# EAGLE design drv (EAGLE 7.2.0)
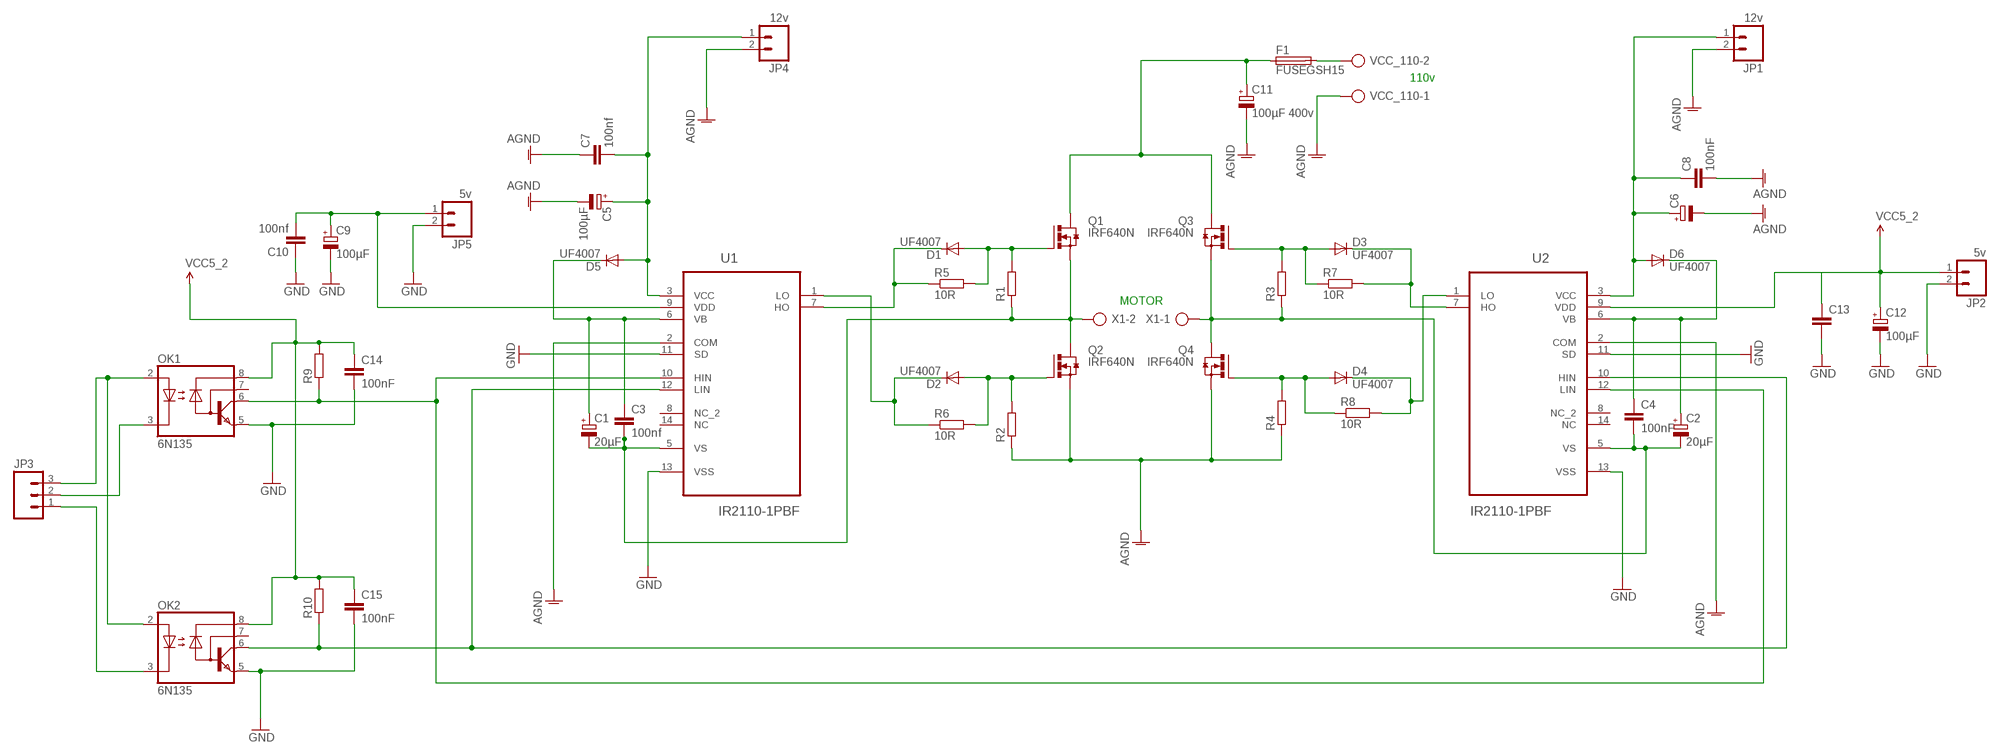
[diagram p0: schematic, sheet 1]

## Parts
C1  20µF  CPOL-EUE2,5-6E  [E2,5-6E]
C2  20µF  CPOL-EUE2,5-6E  [E2,5-6E]
C3  100nf  C-EUC0805  [C0805]
C4  100nF  C-EUC0504  [C0504]
C5  100µF  CPOL-EUE2-5  [E2-5]
C6  CPOL-EUE2-5  [E2-5]
C7  100nf  C-EUC1310  [C1310]
C8  100nF  C-EUC0805  [C0805]
C9  100µF  CPOL-EUE2-5  [E2-5]
C10  100nf  C-EUC0805  [C0805]
C11  100µF 400v  CPOL-EUE10-25  [EB25D]
C12  100µF  CPOL-EUE2-5  [E2-5]
C13  C-EUC0805  [C0805]
C14  100nF  C-EUC0805  [C0805]
C15  100nF  C-EUC0805  [C0805]
D1  UF4007  DIODE  [DIODE-1N4001-KIT]
D2  UF4007  DIODE  [DIODE-1N4001-KIT]
D3  UF4007  DIODE  [DIODE-1N4001-KIT]
D4  UF4007  DIODE  [DIODE-1N4001-KIT]
D5  UF4007  DIODE  [DIODE-1N4001-KIT]
D6  UF4007  DIODE  [DIODE-1N4001-KIT]
F1  FUSEGSH15  [GSH15]
JP1  12v  M02JST-PTH-VERT  [JST-2-PTH-VERT]
JP2  5v  M02JST-PTH-VERT  [JST-2-PTH-VERT]
JP3  M03LOCK  [1X03_LOCK]
JP4  12v  M02JST-PTH-VERT  [JST-2-PTH-VERT]
JP5  5v  M02JST-PTH-VERT  [JST-2-PTH-VERT]
OK1  6N135  [DIL08]
OK2  6N135  [DIL08]
Q1  IRF640N  IRF3704  [TO220AH]
Q2  IRF640N  IRF3704  [TO220AH]
Q3  IRF640N  IRF3704  [TO220AH]
Q4  IRF640N  IRF3704  [TO220AH]
R1  R-EU_0207/12  [0207/12]
R2  R-EU_0207/12  [0207/12]
R3  R-EU_0207/12  [0207/12]
R4  R-EU_0207/12  [0207/12]
R5  10R  R-EU_0207/12  [0207/12]
R6  10R  R-EU_0207/12  [0207/12]
R7  10R  R-EU_0207/12  [0207/12]
R8  10R  R-EU_0207/12  [0207/12]
R9  R-EU_R0805  [R0805]
R10  R-EU_R0805  [R0805]
U1  IR2110-1PBF  [DIP254P762X533-14]
U2  IR2110-1PBF  [DIP254P762X533-14]
VCC_110  AK300/2  [AK300/2]
X1  AK300/2  [AK300/2]

## Nets
110_1: F1.2 VCC_110.2
AGND: C5.- C6.- C7.1 C8.2 C11.- JP1.2 JP4.2 Q2.E(S) Q4.E(S) R2.1 R4.1 U1.2(COM) U2.2(COM) VCC_110.1
GND: C9.- C10.1 C12.- C13.2 C14.2 C15.2 JP2.2 JP5.2 OK1.5(GND) OK2.5(GND) U1.11(SD) U1.13(VSS) U2.11(SD) U2.13(VSS)
N$1: D1.A Q1.B(G) R1.2 R5.2
N$3: JP3.3 OK1.2(A) OK2.2(A)
N$4: D2.A Q2.B(G) R2.2 R6.2
N$5: D1.C R5.1 U1.7(HO)
N$6: JP3.2 OK1.3(C)
N$7: D2.C R6.1 U1.1(LO)
N$9: D3.A Q3.B(G) R3.2 R7.1
N$10: D3.C R7.2 U2.7(HO)
N$11: D4.C R8.2 U2.1(LO)
N$12: JP3.1 OK2.3(C)
N$14: D4.A Q4.B(G) R4.2 R8.1
N$15: C1.+ C3.1 D5.C U1.6(VB)
N$17: C2.+ C4.1 D6.C U2.6(VB)
N$18: OK1.6(VO) R9.1 U1.10(HIN) U2.12(LIN)
N$21: OK2.6(VO) R10.1 U1.12(LIN) U2.10(HIN)
OUT1: C2.- C4.2 Q3.E(S) Q4.C(D) R3.1 U2.5(VS) X1.1
OUT2: C1.- C3.2 Q1.E(S) Q2.C(D) R1.1 U1.5(VS) X1.2
VCC5_2: C12.+ C13.1 C14.1 C15.1 JP2.1 OK1.8(VCC) OK2.8(VCC) R9.2 R10.2 U2.9(VDD)
VCC_5_1: C9.+ C10.2 JP5.1 U1.9(VDD)
VCC_12_1: C5.+ C7.2 D5.A JP4.1 U1.3(VCC)
VCC_12_2: C6.+ C8.1 D6.A JP1.1 U2.3(VCC)
VCC_110: C11.+ F1.1 Q1.C(D) Q3.C(D)
Unconnected: OK1.7(VB) OK2.7(VB) U1.8(NC_2) U1.14(NC) U2.8(NC_2) U2.14(NC)

## Notes on the sheet
- 110v
- MOTOR

## Library data of the parts
C1 C2 C5 C6 C9 C11 C12 = rcl:CPOL-EU: POLARIZED CAPACITOR, European symbol
C3 C4 C7 C8 C10 C13-C15 = rcl:C-EU: CAPACITOR, European symbol
D1-D6 = SparkFun-DiscreteSemi:DIODE: Diode These are standard reverse protection diodes and small signal diodes. SMA package can handle up to about 1A. SOD-323 can handle about 200mA. What the SOD-323 package when ordering, there are some mfgs out there that are 5-pin packages.
F1 = fuse:FUSE: Fuse; OC_FARNELL: unknown; OC_NEWARK: unknown
JP1 JP2 JP4 JP5 = SparkFun-Connectors:M02: Standard 2-pin 0.1" header. Use with - straight break away headers ( PRT-00116) - right angle break away headers (PRT-00553) - swiss pins (PRT-00743) - machine pins (PRT-00117) - female headers (PRT-00115) Molex polarized connector foot print use with: PRT-08233 with associated crimp pins and housings. 2.54_SCREWTERM for use with PRT-10571. 3.5mm Screw Terminal footprints for PRT-08084 5mm Screw Terminal footprints for use with PRT-08433
JP3 = SparkFun-Connectors:M03: Header 3 Standard 3-pin 0.1" header. Use with straight break away headers (SKU : PRT-00116), right angle break away headers (PRT-00553), swiss pins (PRT-00743), machine pins (PRT-00117), and female headers (PRT-00115). Molex polarized connector foot print use with SKU : PRT-08232 with associated crimp pins and housings.
OK1 OK2 = optocoupler:6N135: MOTOROLA OPTO COUPLER; MF: FAIRCHILD SEMICONDUCTOR; MPN: 6N135; OC_FARNELL: 1021342; OC_NEWARK: 58K9658
Q1-Q4 = transistor-power:IRF3704: SMPS MOSFET HEXFET® Power MOSFET Source: http://www.irf.com/product-info/datasheets/data/irf3704.pdf
R1-R10 = rcl:R-EU_: RESISTOR, European symbol
U1 U2 = International_Rectifier_By_element14_Batch_1:IR2110-1PBF: HIGH AND LOW SIDE DRIVER; MPN: IR2110-1PBF; OC_FARNELL: 1374799; OC_NEWARK: 19K8414; PACKAGE: PDIP-14; SUPPLIER: INTERNATIONAL RECTIFIER
VCC_110 X1 = con-ptr500:AK300/2: CONNECTOR; OC_FARNELL: unknown; OC_NEWARK: unknown

## Board
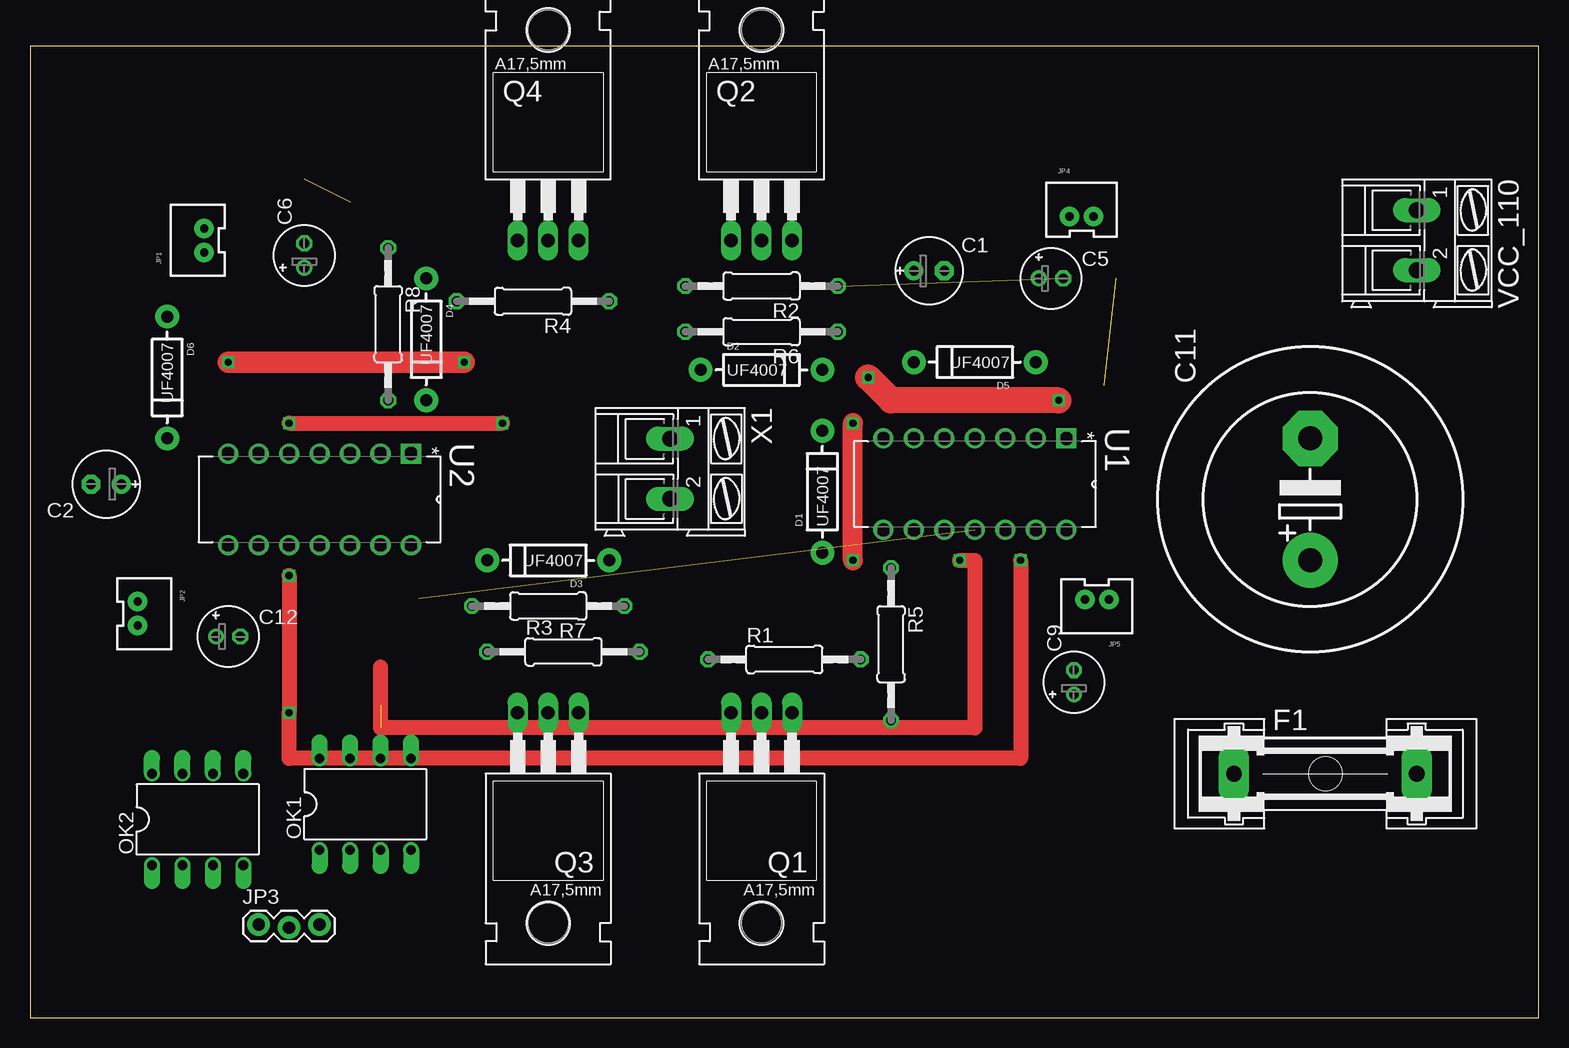
[diagram p1: board, top side]
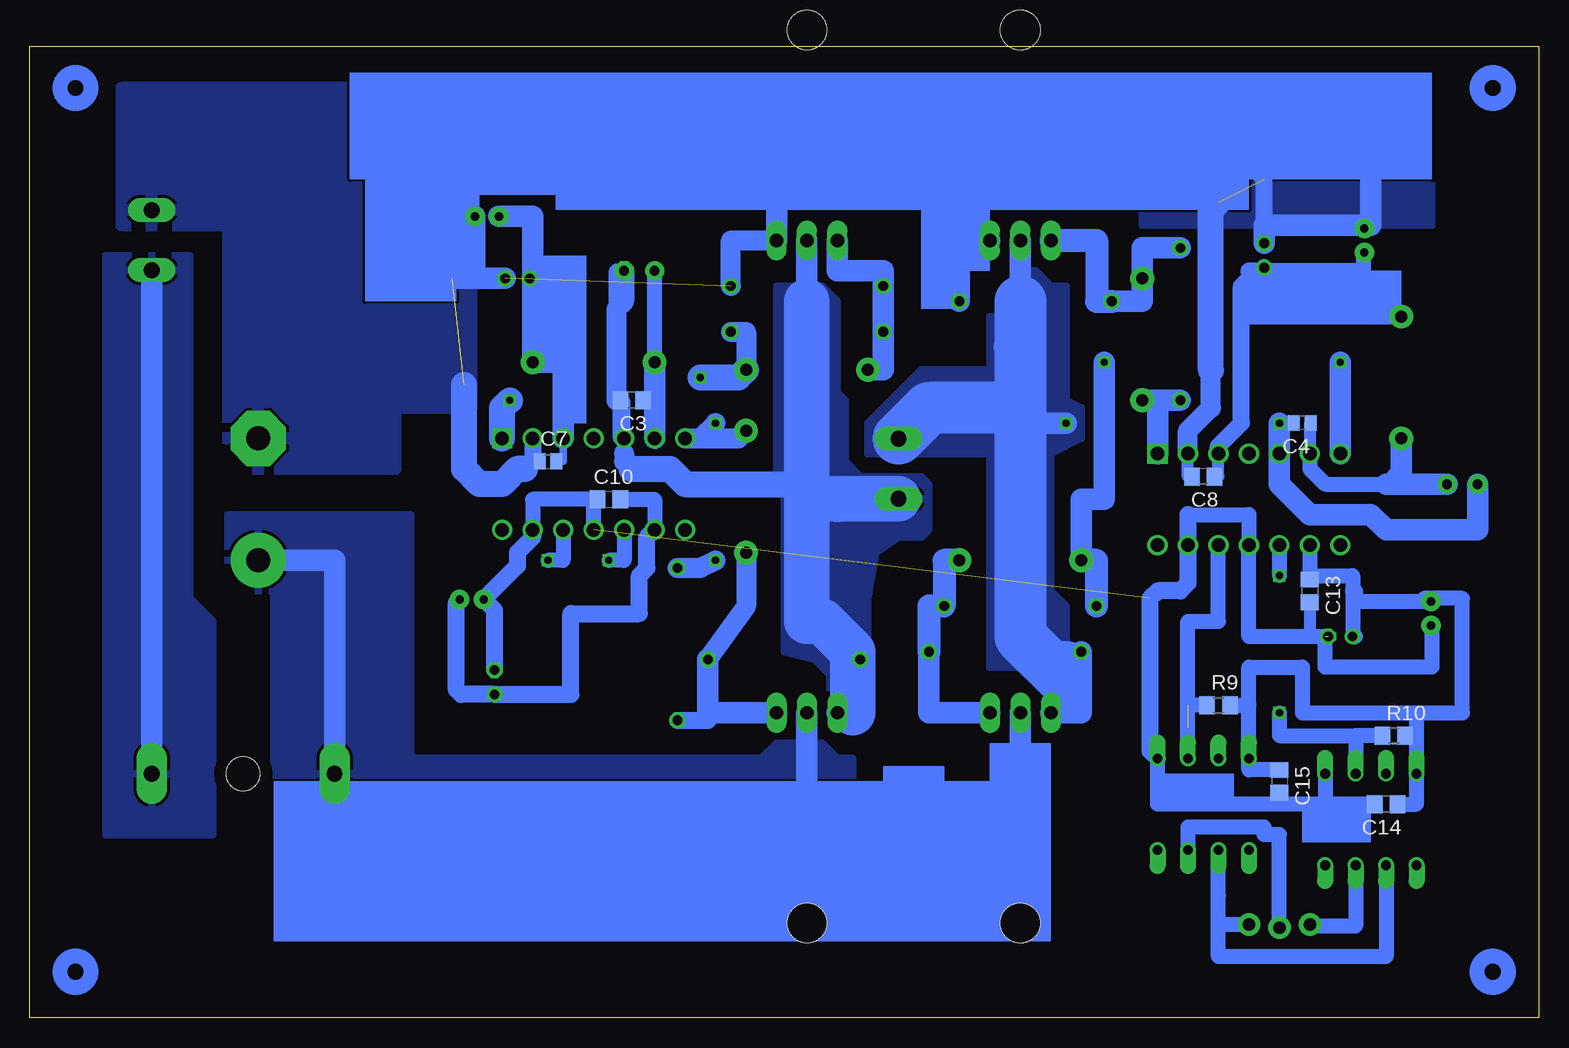
[diagram p2: board, bottom side, seen from below]

Size 125.71 x 80.95 mm. Coordinates in mm from the lower left corner, seen from the top.
Outline: 0,0 125.71,0 125.71,80.95 0,80.95 0,0
Copper layers (1*16): Top 0.035mm / dielectric 1.5mm / Bottom 0.035mm
Design rules "default": minimum track width 10mil, minimum drill 24mil, track to track 8mil, track to pad 8mil, pad to pad 8mil, via to via 8mil, smd to smd 8mil, copper to edge 40mil, drill to drill 8mil, minimum pad ring 10mil, minimum via ring 8mil, stop-mask expansion 4mil, vias tented up to drill 0mil, thermal gap 10mil

### Footprints (pad centres in the part's own frame; a part is rotated, then mirrored left to right if it is on the bottom)
E2,5-6E = drill 0.813 pad 1.575: + -1.27,0 | drill 0.813 pad 1.575 octagon: - 1.27,0
C0805 = smd 1.3 x 1.5: 1 -0.95,0; 2 0.95,0
C0504 = smd 1 x 1.3: 1 -0.7,0; 2 0.7,0
E2-5 = drill 0.813 pad 1.27: + -1.016,0 | drill 0.813 pad 1.27 octagon: - 1.016,0
C1310 = smd 1 x 1.3: 1 -0.7,0; 2 0.7,0
EB25D = drill 2.007 pad 4.597: + -5.08,0 | drill 2.007 pad 4.597 octagon: - 5.08,0
DIODE-1N4001-KIT = drill 1 pad 1.981: A -5.08,0; C 5.08,0
GSH15 = drill 1.321 pad 2.54 long: 1 -7.62,0; 2 7.62,0 | hole 2.794: 0,0
JST-2-PTH-VERT = drill 0.7 pad 1.626: 1 -1,-0.55; 2 1,-0.55
1X03_LOCK = drill 1.016 pad 1.88: 1 0,0.127; 2 2.54,-0.127; 3 5.08,0.127
DIL08 = drill 0.813 offset: 1 -3.81,-3.81; 2 -1.27,-3.81; 3 1.27,-3.81; 4 3.81,-3.81; 5 3.81,3.81; 6 1.27,3.81; 7 -1.27,3.81; 8 -3.81,3.81
TO220AH = drill 1.118 long: B -2.54,-6.35; C 0,-6.35; E 2.54,-6.35 | hole 3.302: 0,11.176
0207/12 = drill 0.813 octagon: 1 -6.35,0; 2 6.35,0
R0805 = smd 1.3 x 1.5: 1 -0.95,0; 2 0.95,0
DIP254P762X533-14 = drill 1.118 square: 1 -7.62,15.24 | drill 1.118: 2 -7.62,12.7; 3 -7.62,10.16; 4 -7.62,7.62; 5 -7.62,5.08; 6 -7.62,2.54; 7 -7.62,0; 8 0,0; 9 0,2.54; 10 0,5.08; 11 0,7.62; 12 0,10.16; 13 0,12.7; 14 0,15.24
AK300/2 = drill 1.321 long: 1 -2.515,0; 2 2.489,0

### Placement (x,y rotation side)
C1  74.93,62.23 0 top
C2  6.35,44.45 180 top
C3  75.56,51.43 180 bottom
C4  19.68,49.53 180 bottom
C5  85.09,61.6 0 top
C6  22.86,63.5 90 top
C7  82.55,46.35 0 bottom
C8  27.94,45.09 180 bottom
C9  87,27.94 90 top
C10  77.47,43.18 0 bottom
C11  106.68,43.18 90 top
C12  16.51,31.75 0 top
C13  19.05,35.56 270 bottom
C14  12.7,17.78 180 bottom
C15  21.59,19.68 270 bottom
D1  66.04,43.82 90 top
D2  60.96,53.98 0 top
D3  43.18,38.1 180 top
D4  33.02,56.51 270 top
D5  78.74,54.61 180 top
D6  11.43,53.34 270 top
F1  107.95,20.32 0 top
JP1  13.97,64.77 90 top
JP2  9.53,33.65 270 top
JP3  19.05,7.62 0 top
JP4  87.63,67.31 0 top
JP5  88.9,34.29 180 top
OK1  27.94,17.78 0 top
OK2  13.97,16.51 0 top
Q1  60.96,19.05 180 top
Q2  60.96,71.12 0 top
Q3  43.18,19.05 180 top
Q4  43.18,71.12 0 top
R1  62.87,29.85 0 top
R2  60.96,60.96 180 top
R3  44.45,30.48 0 top
R4  41.91,59.69 180 top
R5  71.75,31.12 270 top
R6  60.96,57.15 180 top
R7  43.18,34.29 180 top
R8  29.84,57.79 270 top
R9  26.67,26.04 0 bottom
R10  12.06,23.49 0 bottom
U1  71.12,40.64 270 top
U2  16.51,39.37 270 top
VCC_110  115.57,64.77 270 top
X1  53.34,45.72 270 top

### Tracks (layer width: path | path; a pad name or v marks a point on that pad's centre or on a via)
110_1
  Bottom 1.778: VCC_110.2 F1.2
  pour Bottom: 112.39,63.5 119.38,63.5 119.38,15.24 110.49,15.24 110.49,33.02 112.39,34.93
AGND  (3 unrouted)
  Bottom 0.61: C7.1 83.82,46.35
  Bottom 1.016: C8.2 29.21,45.09 U2.2
  Bottom 1.422: 22.86,66.04 22.86,69.85 29.21,76.2 46.99,76.2 48.26,74.93 48.26,64.77 | U1.2 83.82,46.35 84.45,45.72
  Bottom 1.676: R2.1 67.31,64.77 Q2.E | U2.2 29.21,48.9 27.3,50.8 27.3,53.98
  Bottom 1.778: 90.53,61.6 88.63,61.6 | 88.63,61.6 JP4.2 | C5.- 88.63,61.6 | Q4.E 46.99,64.77 46.99,76.2 | 46.99,76.2 31.75,76.2 31.75,74.93 13.97,74.93 13.97,66.04 22.86,66.04 C6.- | Q2.E 63.5,76.2 46.99,76.2 | R4.1 48.26,64.77 48.26,72.39
  Bottom 2.184: 27.3,53.98 27.3,67.31 26.67,67.94 | 84.45,45.72 85.09,45.72 86.36,44.45 88.27,44.45 89.53,45.72 89.53,52.71
  pour Bottom: 13.97,66.04 8.89,66.04 8.89,77.47 33.02,77.47 33.02,66.04
  pour Bottom: 33.02,77.47 88.9,77.47 88.27,69.85 63.5,71.12 45.72,71.12 45.72,68.58 31.75,68.58 33.02,76.2
  pour Bottom: 88.9,77.47 118.11,77.47 118.11,66.04 109.22,66.04 109.22,45.72 95.25,45.72 95.25,50.8 88.9,50.8 88.9,76.2
GND  (2 unrouted)
  Bottom 1.016: C13.2 19.05,31.75
  Bottom 1.27: U2.13 29.21,41.91 24.13,41.91 U2.11 24.13,31.75 19.05,31.75 17.78,31.75 17.78,29.21 8.89,29.21 8.89,32.65 JP2.2 | OK2.5 17.78,17.78 | 17.78,17.78 21.59,17.78 | 21.59,17.78 31.75,17.78 OK1.5 | C14.2 17.78,17.78 | C15.2 21.59,17.78 | C10.1 78.74,43.18 | 78.74,43.18 83.82,43.18 U1.13 | U1.11 78.74,43.18
  Bottom 1.422: C9.- 87,33.93 JP5.2 85.09,37.65 85.09,38.73 83.82,40.01 U1.13 | 29.21,41.91 29.21,36.2 29.84,35.56 31.75,35.56 32.38,34.93 32.38,22.23 OK1.5
N$1
  Bottom 1.422: R5.2 69.22,24.76 68.58,25.4
  Bottom 1.676: D1.A 66.04,34.29 R1.2
  Bottom 1.778: Q1.B 68.58,25.4 69.22,25.4 R1.2
N$2
  pour Bottom: 46.99,16.51 46.99,13.97 41.91,17.78
N$3
  Bottom 1.27: JP3.3 26.67,7.75 | 26.67,7.75 26.67,10.16 OK1.2 | OK2.2 12.7,5.08 26.67,5.08 26.67,7.75
N$4
  Bottom 1.778: Q2.B 58.42,62.23 54.61,62.23 R2.2 R6.2 54.61,53.98 D2.A
N$5  (via drill 0.6)
  Top 1.676: v68.58,38.1 v68.58,49.53
  Bottom 1.676: U1.7 69.85,48.26 | 69.85,48.26 66.67,48.26 D1.C | R5.1 69.85,37.46 v68.58,38.1 | v68.58,49.53 69.85,48.26
N$6
  Bottom 1.27: JP3.2 21.59,15.24 22.86,15.24 22.86,15.87 29.21,15.87 OK1.3
N$7  (via drill 0.6)
  Top 2.184: v85.72,51.43 71.75,51.43 v69.85,53.34
  Bottom 1.676: R6.1 66.04,57.15 D2.C
  Bottom 2.184: U1.1 86.36,50.8 v85.72,51.43 | v69.85,53.34 66.67,53.34 D2.C
N$9
  Bottom 1.778: Q3.B 50.8,25.4 R3.2
  Bottom 1.93: R3.2 50.8,34.29 R7.1 49.53,38.1 D3.A
N$10  (via drill 0.6)
  Top 1.778: v36.2,54.61 v16.51,54.61
  Bottom 1.778: 38.1,39.37 D3.C 38.1,43.18 36.2,43.18 v36.2,54.61 | v16.51,54.61 U2.7
  Bottom 1.93: R7.2 36.83,38.1 D3.C
N$11
  Bottom 1.778: R8.2 31.75,51.43 | 31.75,51.43 D4.C | U2.1 31.75,51.43
N$12
  Bottom 1.27: OK2.3 15.24,7.62 19.05,7.62 JP3.1
N$14
  Bottom 1.778: R8.1 33.02,64.13 D4.A 33.02,59.69 R4.2
  Bottom 1.93: Q4.B 36.83,64.77 36.83,59.69 R4.2
N$15
  Bottom 1.27: C3.1 73.66,51.43 73.66,52.07 | D5.C C1.+
  Bottom 1.778: U1.6 73.66,52.07 D5.C
N$17
  Bottom 1.016: C4.1 19.05,49.53 U2.6
  Bottom 1.27: U2.6 19.05,45.72 17.78,44.45 12.7,44.45 11.43,45.72
  Bottom 1.778: 11.43,44.45 11.43,45.72 D6.C | C2.+ 11.43,44.45 | 11.43,44.45 12.7,44.45
N$18  (via drill 0.6)  (1 unrouted)
  Top 1.27: v77.47,38.1 78.74,38.1 78.74,24.13 29.21,24.13 29.21,29.21
  Bottom 1.27: OK1.6 29.21,26.04 | 29.21,26.04 29.21,33.02 26.67,33.02 U2.12 | R9.1 29.21,26.04 | U1.10 76.2,38.1 v77.47,38.1
N$21  (via drill 0.6)
  Top 1.27: v21.59,36.83 v21.59,25.4 21.59,21.59 82.55,21.59 v82.55,38.1
  Bottom 1.27: U2.10 v21.59,36.83 | v21.59,25.4 21.59,23.49 15.24,23.49 | 15.24,23.49 OK2.6 | R10.1 15.24,23.49 | U1.12 81.28,38.1 v82.55,38.1
OUT1  (via drill 0.6)
  Top 1.27: v21.59,49.53 v39.37,49.53
  Bottom 1.016: C4.2 v21.59,49.53 | 39.37,29.21 38.1,29.21 R3.1
  Bottom 1.27: U2.5 v21.59,49.53 | 44.45,50.8 44.45,55.88
  Bottom 1.778: R3.1 38.1,25.4 Q3.E | v21.59,49.53 21.59,44.45 19.05,41.91 13.97,41.91 12.7,40.64 5.08,40.64 C2.- | v39.37,49.53 43.18,49.53 | Q4.C 43.18,59.69
  Bottom 1.93: 44.45,55.88 43.18,55.88 43.18,57.15
  Bottom 4.318: 43.18,49.53 44.45,50.8 50.77,50.8 X1.1 | 43.18,59.69 43.18,57.15 43.18,31.75 39.37,27.94 39.37,29.21
  pour Bottom: 44.45,58.42 45.72,58.42 45.72,53.98 51.44,53.98 55.88,49.53 55.88,46.99 45.72,46.99 45.72,29.21 39.37,29.21 39.37,34.29 40.64,35.56 40.64,46.99 38.1,48.26 38.1,50.8 39.37,51.43 39.37,60.96 40.64,60.96 41.91,62.23 43.18,62.23
OUT2
  Bottom 0.813: 76.83,51.43 76.2,51.43
  Bottom 1.016: C3.2 76.2,51.43 76.2,46.99
  Bottom 1.27: U1.5 76.52,48.26 C3.2 76.83,51.43 | 76.83,59.05 76.83,62.23 C1.-
  Bottom 1.676: C1.- 76.2,59.69 76.83,59.05 76.83,51.43 | 76.2,46.99 76.2,46.35 75.56,45.72
  Bottom 1.778: Q1.E R1.1 | 60.96,59.69 Q2.C
  Bottom 2.184: 75.56,45.72 72.39,45.72 71.12,44.45 60.96,44.45
  Bottom 3.81: 58.42,43.18 58.37,43.23 X1.2 59.64,43.23 59.69,43.18 60.96,43.18 | 57.15,25.4 57.15,30.48 59.69,33.02 60.96,33.02 60.96,43.18 | 60.96,43.18 60.96,44.45 60.96,59.69
  pour Bottom: 59.69,60.96 58.42,59.69 58.42,52.07 57.78,51.43 57.78,46.35 56.52,45.09 51.44,45.09 50.8,44.45 50.8,40.64 51.44,40.01 53.34,40.01 55.24,38.73 55.88,34.93 55.88,24.76 58.42,24.76 59.05,24.13 59.05,28.57 60.33,29.85 62.87,30.48 62.87,43.18 63.5,44.45 63.5,60.96
VCC5_2
  Bottom 0.61: C13.1 19.05,36.83
  Bottom 1.27: U2.9 19.05,36.83 15.49,36.83 15.49,35.56 | 15.49,35.56 C12.+ 15.24,31.75 | 15.49,35.56 15.24,35.56 15.24,34.65 9.53,34.65 | 24.13,26.04 OK1.8 24.13,20.63 C15.1 | 24.13,26.04 24.13,29.21 19.68,29.21 19.68,25.4 10.16,25.4 | 10.16,23.49 OK2.8 10.16,17.78 C14.1 | 10.16,23.49 10.16,25.4 | R10.2 10.16,23.49 | R9.2 24.13,26.04 | JP2.1 9.53,34.65 | 10.16,25.4 6.35,25.4 6.35,34.93 9.53,34.93 9.53,34.65
VCC_5_1
  Bottom 1.27: U1.9 73.66,43.18 C10.2
  Bottom 1.422: U1.9 74.3,40.01 74.3,37.46 74.93,36.83 74.93,33.65 80.64,33.65 80.64,26.92 C9.+ 89.79,26.92 90.17,27.3 90.17,34.57 JP5.1
VCC_12_1
  Bottom 0.61: C7.2 81.28,46.35 U1.3
  Bottom 1.016: C5.+ 83.82,60.32 83.82,59.69
  Bottom 1.778: U1.3 81.28,54.61 D5.A 83.82,59.69 83.82,66.76 JP4.1
VCC_12_2
  Bottom 1.016: C8.1 26.67,45.09 U2.3
  Bottom 1.27: D6.A 22.86,58.42 22.86,62.23 14.61,62.23 14.61,63.77 JP1.1
  Bottom 1.422: 24.13,62.23 23.5,62.23 | 23.5,62.23 22.86,62.23 C6.+ | U2.3 26.67,47.62 24.77,49.53 24.77,60.96 23.5,62.23
VCC_110
  Bottom 1.778: 60.96,13.97 100.33,13.97 F1.1 100.33,38.1 C11.+ | 60.96,13.97 Q1.C | Q3.C 43.18,13.97 60.96,13.97
  pour Bottom: 93.98,41.91 109.22,41.91 109.22,35.56 105.41,35.56 105.41,6.35 41.91,6.35 41.91,22.86 46.99,22.86 46.99,19.05 49.53,16.51 54.61,16.51 57.15,19.05 57.15,21.59 58.42,21.59 59.69,22.86 63.5,22.86 64.77,21.59 93.98,21.59
(copper drawn outside any net)
  shapes: Bottom area x27, Bottom circle x4